# Altium project PCB_Project.PrjPcb
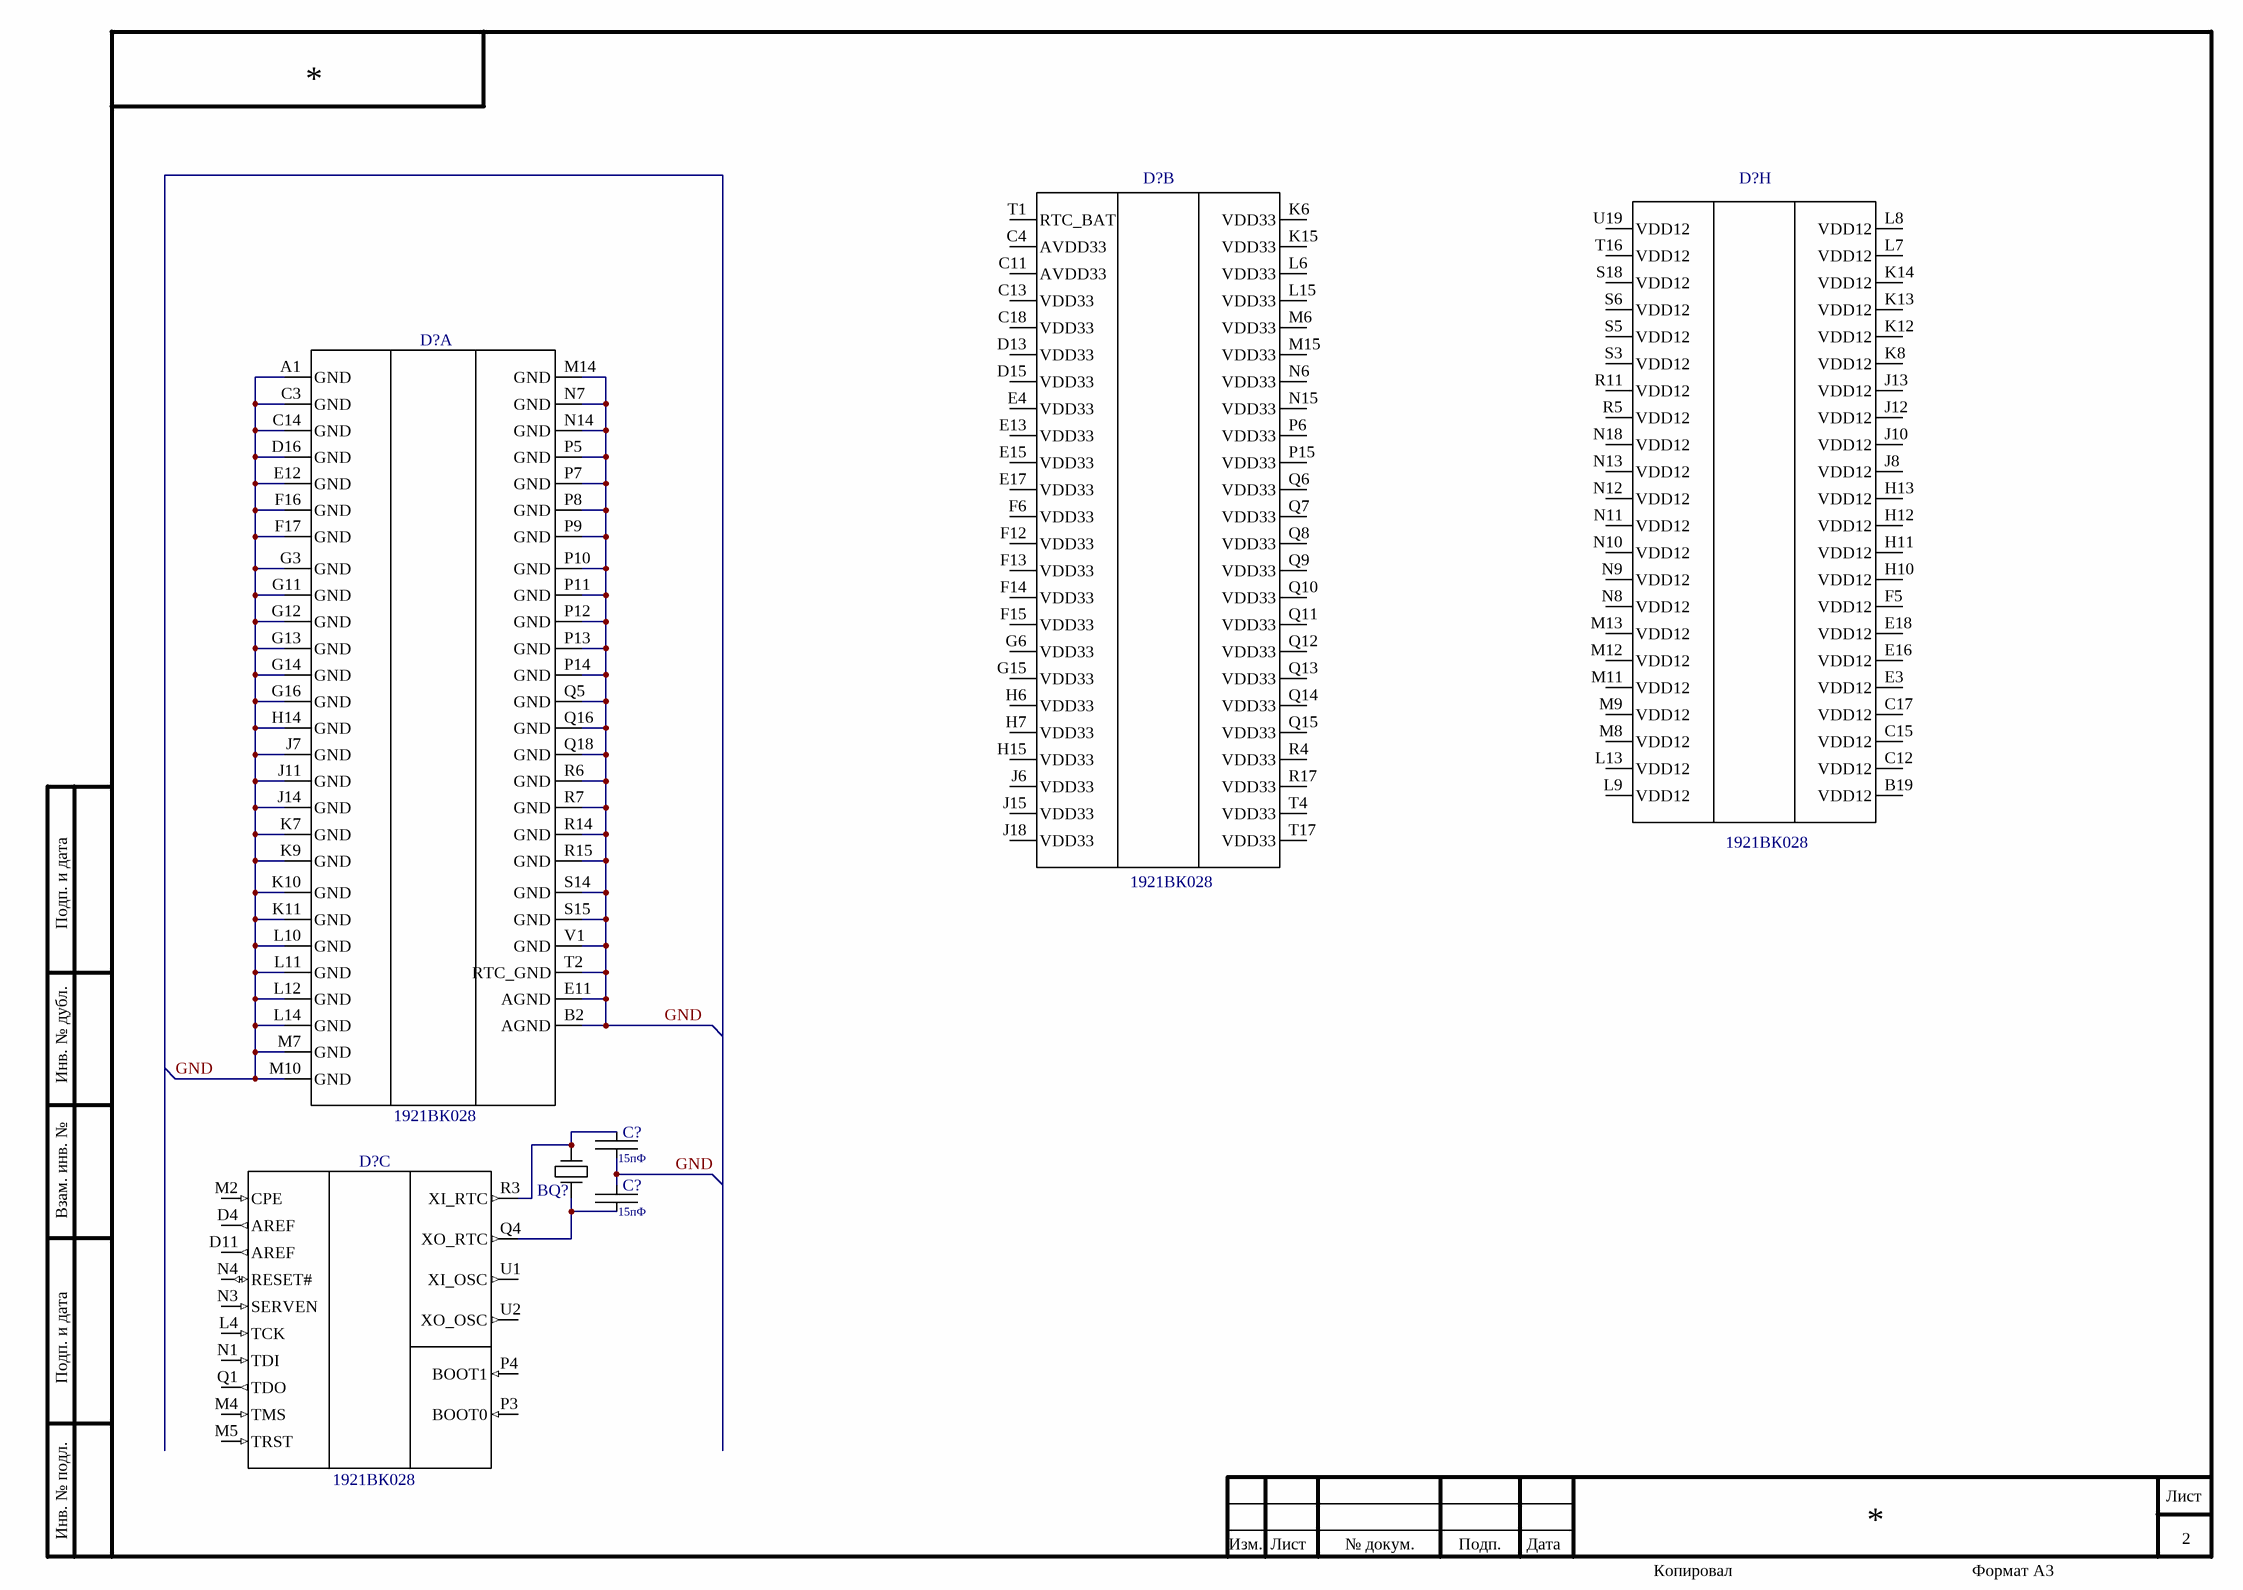
[diagram p0: MCU1.SchDoc]
3 sheets, 45 parts. Net scope: global (net labels, ports and power ports of the same name join across sheets).
Sheets:
  MCU1.SchDoc
  MCU2.SchDoc
  InterfMCU.SchDoc

## Sheet MCU1.SchDoc
size 420 x 297 mm; Address1: Address1; Address2: Address2; Address3: Address3; Address4: Address4; SheetNumber: 2; SheetTotal: 4; Scale: 1:1; DocumentType: Схема электрическая принципиальная

### Parts
(Parts that share a designator on the sheet are numbered #1, #2 ... from top to bottom, then left to right.)
BQ?  РК206  (value not drawn)
C?#1  15пФ
C?#2  15пФ
D?#1  1921ВК028  (part H of 8)
D?#2  1921ВК028  (part B of 8)
D?#3  1921ВК028  (part A of 8)
D?#4  1921ВК028  (part C of 8)

### Nets
GND: C?#1.2 C?#2.1 D?#3.A1(GND) D?#3.B2(AGND) D?#3.C3(GND) D?#3.C14(GND) D?#3.D16(GND) D?#3.E11(AGND) D?#3.E12(GND) D?#3.F16(GND) D?#3.F17(GND) D?#3.G3(GND) D?#3.G11(GND) D?#3.G12(GND) D?#3.G13(GND) D?#3.G14(GND) D?#3.G16(GND) D?#3.H14(GND) D?#3.J7(GND) D?#3.J11(GND) D?#3.J14(GND) D?#3.K7(GND) D?#3.K9(GND) D?#3.K10(GND) D?#3.K11(GND) D?#3.L10(GND) D?#3.L11(GND) D?#3.L12(GND) D?#3.L14(GND) D?#3.M7(GND) D?#3.M10(GND) D?#3.M14(GND) D?#3.N7(GND) D?#3.N14(GND) D?#3.P5(GND) D?#3.P7(GND) D?#3.P8(GND) D?#3.P9(GND) D?#3.P10(GND) D?#3.P11(GND) D?#3.P12(GND) D?#3.P13(GND) D?#3.P14(GND) D?#3.Q5(GND) D?#3.Q16(GND) D?#3.Q18(GND) D?#3.R6(GND) D?#3.R7(GND) D?#3.R14(GND) D?#3.R15(GND) D?#3.S14(GND) D?#3.S15(GND) D?#3.T2(RTC_GND) D?#3.V1(GND)
NetBQ?_1: BQ?.1 C?#2.2 D?#4.Q4(XO_RTC)
NetBQ?_4: BQ?.4 C?#1.1 D?#4.R3(XI_RTC)

Not connected (* = marked no-connect by the designer): D?#1 B19(VDD12) C12(VDD12) C15(VDD12) C17(VDD12) E3(VDD12) E16(VDD12) E18(VDD12) F5(VDD12) H10(VDD12) H11(VDD12) H12(VDD12) H13(VDD12) J8(VDD12) J10(VDD12) J12(VDD12) J13(VDD12) K8(VDD12) K12(VDD12) K13(VDD12) K14(VDD12) L7(VDD12) L8(VDD12) L9(VDD12) L13(VDD12) M8(VDD12) M9(VDD12) M11(VDD12) M12(VDD12) M13(VDD12) N8(VDD12) N9(VDD12) N10(VDD12) N11(VDD12) N12(VDD12) N13(VDD12) N18(VDD12) R5(VDD12) R11(VDD12) S3(VDD12) S5(VDD12) S6(VDD12) S18(VDD12) T16(VDD12) U19(VDD12); D?#2 C4(AVDD33) C11(AVDD33) C13(VDD33) C18(VDD33) D13(VDD33) D15(VDD33) E4(VDD33) E13(VDD33) E15(VDD33) E17(VDD33) F6(VDD33) F12(VDD33) F13(VDD33) F14(VDD33) F15(VDD33) G6(VDD33) G15(VDD33) H6(VDD33) H7(VDD33) H15(VDD33) J6(VDD33) J15(VDD33) J18(VDD33) K6(VDD33) K15(VDD33) L6(VDD33) L15(VDD33) M6(VDD33) M15(VDD33) N6(VDD33) N15(VDD33) P6(VDD33) P15(VDD33) Q6(VDD33) Q7(VDD33) Q8(VDD33) Q9(VDD33) Q10(VDD33) Q11(VDD33) Q12(VDD33) Q13(VDD33) Q14(VDD33) Q15(VDD33) R4(VDD33) R17(VDD33) T1(RTC_BAT) T4(VDD33) T17(VDD33); D?#4 D4(AREF) D11(AREF) L4(TCK) M2(CPE) M4(TMS) M5(TRST) N1(TDI) N3(SERVEN) N4(RESET#) P3(BOOT0) P4(BOOT1) Q1(TDO) U1(XI_OSC) U2(XO_OSC)

### Notes on the sheet
- Подп. и дата
- Инв. № дубл.
- Взам. инв. №
- Инв. № подл.
- Изм.
- Лист
- № докум.
- Подп.
- Дата
- Копировал
- Формат А3

### Library data of the parts
BQ? = РК206: Кварцевый резонатор РК206 32кГц
C?#1 C?#2 = К10-69: Керамический чип-конденсатор серии К10-79; PartNumber: К10-69в-*-* В- * ± *% *; TypePrefix: C; TU: АЖЯР.673511.002ТУ; TUHolder: ОАО НИИ "ГИРИКОНД"; Value: *; PackegeType: *
D?#1-D?#4 = 1921ВК028: МК 1921ВК028

## Sheet MCU2.SchDoc
size 420 x 297 mm; Address1: Address1; Address2: Address2; Address3: Address3; Address4: Address4; SheetNumber: 3; SheetTotal: 4; Scale: 1:1; DocumentType: Схема электрическая принципиальная
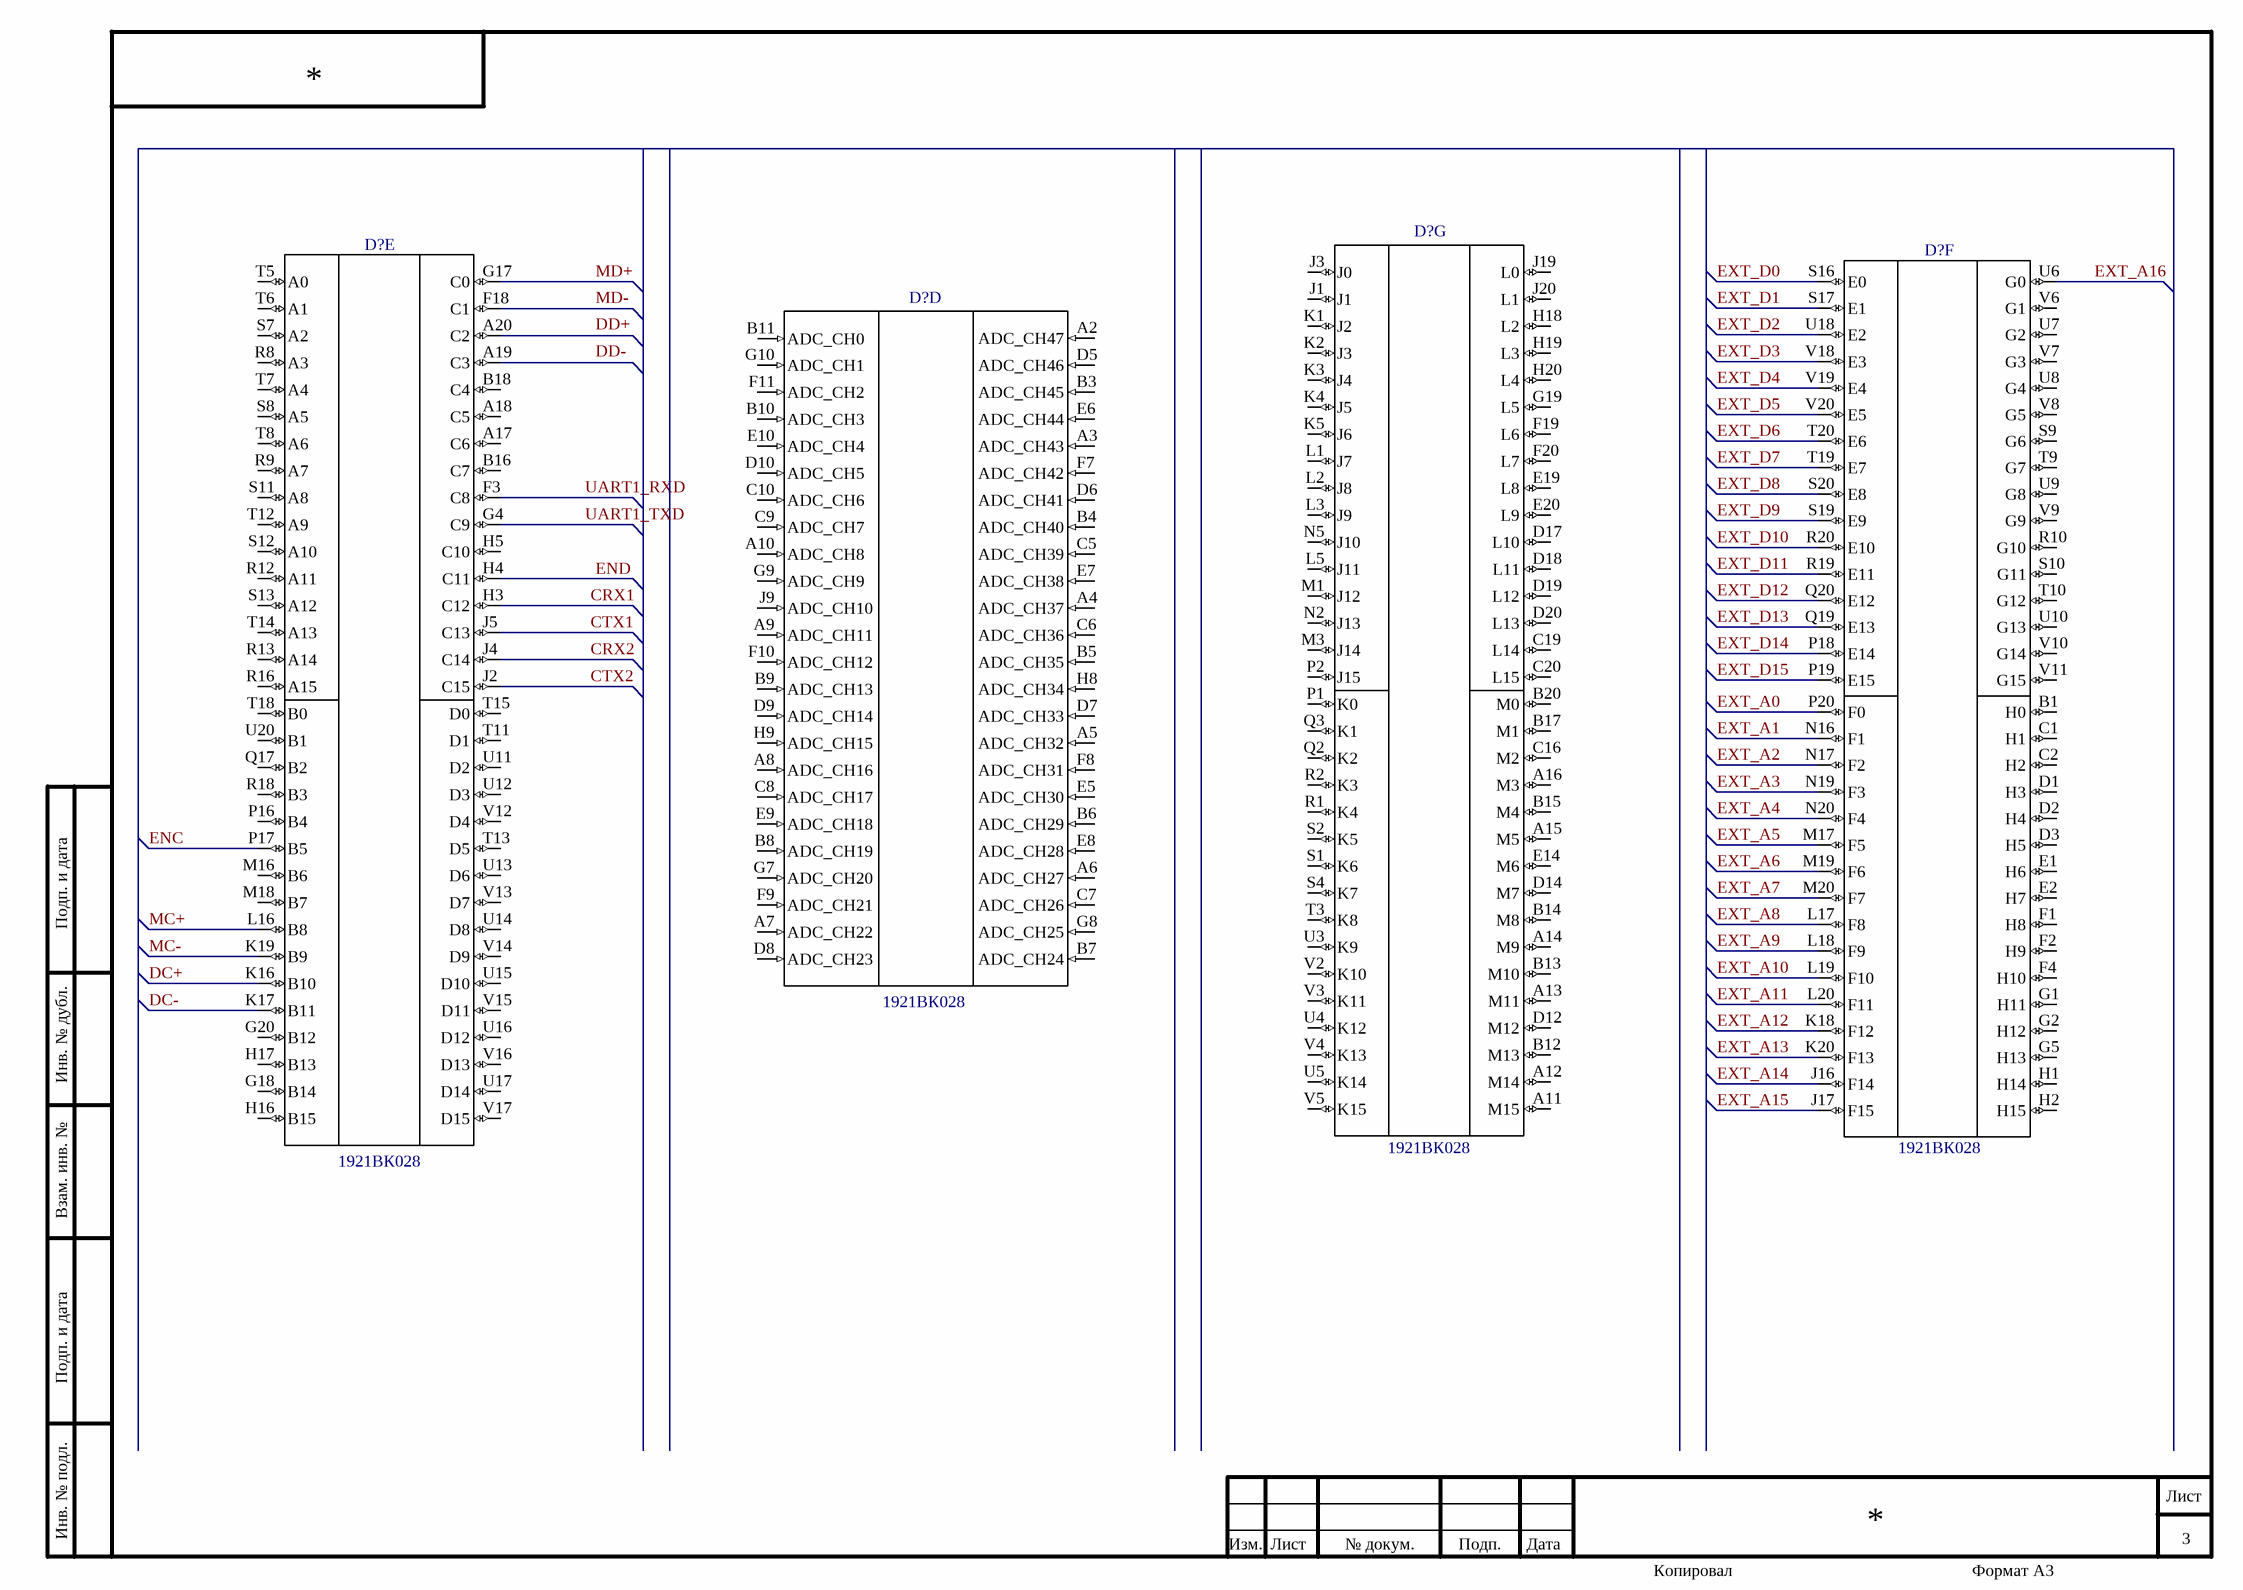
[diagram p1: MCU2.SchDoc]

### Parts
(Parts that share a designator on the sheet are numbered #1, #2 ... from top to bottom, then left to right.)
D?#5  1921ВК028  (part G of 8)
D?#6  1921ВК028  (part E of 8)
D?#7  1921ВК028  (part F of 8)
D?#8  1921ВК028  (part D of 8)

### Nets
CRX1: D?#6.H3(C12)
CRX2: D?#6.J4(C14)
CTX1: D?#6.J5(C13)
CTX2: D?#6.J2(C15)
DC+: D?#6.K16(B10)
DC-: D?#6.K17(B11)
ENC: D?#6.P17(B5)
END: D?#6.H4(C11)
EXT_A0: D?#7.P20(F0)
EXT_A1: D?#7.N16(F1)
EXT_A2: D?#7.N17(F2)
EXT_A3: D?#7.N19(F3)
EXT_A4: D?#7.N20(F4)
EXT_A5: D?#7.M17(F5)
EXT_A6: D?#7.M19(F6)
EXT_A7: D?#7.M20(F7)
EXT_A8: D?#7.L17(F8)
EXT_A9: D?#7.L18(F9)
EXT_A10: D?#7.L19(F10)
EXT_A11: D?#7.L20(F11)
EXT_A12: D?#7.K18(F12)
EXT_A13: D?#7.K20(F13)
EXT_A14: D?#7.J16(F14)
EXT_A15: D?#7.J17(F15)
EXT_A16: D?#7.U6(G0)
EXT_D0: D?#7.S16(E0)
EXT_D1: D?#7.S17(E1)
EXT_D2: D?#7.U18(E2)
EXT_D3: D?#7.V18(E3)
EXT_D4: D?#7.V19(E4)
EXT_D5: D?#7.V20(E5)
EXT_D6: D?#7.T20(E6)
EXT_D7: D?#7.T19(E7)
EXT_D8: D?#7.S20(E8)
EXT_D9: D?#7.S19(E9)
EXT_D10: D?#7.R20(E10)
EXT_D11: D?#7.R19(E11)
EXT_D12: D?#7.Q20(E12)
EXT_D13: D?#7.Q19(E13)
EXT_D14: D?#7.P18(E14)
EXT_D15: D?#7.P19(E15)
MC+: D?#6.L16(B8)
MC-: D?#6.K19(B9)
MD+: D?#6.G17(C0)
MD-: D?#6.F18(C1)
UART1_RXD: D?#6.F3(C8)
UART1_TXD: D?#6.G4(C9)

Not connected (* = marked no-connect by the designer): D?#5 A11(M15) A12(M14) A13(M11) A14(M9) A15(M5) A16(M3) B12(M13) B13(M10) B14(M8) B15(M4) B17(M1) B20(M0) C16(M2) C19(L14) C20(L15) D12(M12) D14(M7) D17(L10) D18(L11) D19(L12) D20(L13) E14(M6) E19(L8) E20(L9) F19(L6) F20(L7) G19(L5) H18(L2) H19(L3) H20(L4) J1 J3(J0) J19(L0) J20(L1) K1(J2) K2(J3) K3(J4) K4(J5) K5(J6) L1(J7) L2(J8) L3(J9) L5(J11) M1(J12) M3(J14) N2(J13) N5(J10) P1(K0) P2(J15) Q2(K2) Q3(K1) R1(K4) R2(K3) S1(K6) S2(K5) S4(K7) T3(K8) U3(K9) U4(K12) U5(K14) V2(K10) V3(K11) V4(K13) V5(K15); D?#6 A17(C6) A18(C5) A19(C3) A20(C2) B16(C7) B18(C4) G18(B14) G20(B12) H5(C10) H16(B15) H17(B13) M16(B6) M18(B7) P16(B4) Q17(B2) R8(A3) R9(A7) R12(A11) R13(A14) R16(A15) R18(B3) S7(A2) S8(A5) S11(A8) S12(A10) S13(A12) T5(A0) T6(A1) T7(A4) T8(A6) T11(D1) T12(A9) T13(D5) T14(A13) T15(D0) T18(B0) U11(D2) U12(D3) U13(D6) U14(D8) U15(D10) U16(D12) U17(D14) U20(B1) V12(D4) V13(D7) V14(D9) V15(D11) V16(D13) V17(D15); D?#7 B1(H0) C1(H1) C2(H2) D1(H3) D2(H4) D3(H5) E1(H6) E2(H7) F1(H8) F2(H9) F4(H10) G1(H11) G2(H12) G5(H13) H1(H14) H2(H15) R10(G10) S9(G6) S10(G11) T9(G7) T10(G12) U7(G2) U8(G4) U9(G8) U10(G13) V6(G1) V7(G3) V8(G5) V9(G9) V10(G14) V11(G15); D?#8 A2(ADC_CH47) A3(ADC_CH43) A4(ADC_CH37) A5(ADC_CH32) A6(ADC_CH27) A7(ADC_CH22) A8(ADC_CH16) A9(ADC_CH11) A10(ADC_CH8) B3(ADC_CH45) B4(ADC_CH40) B5(ADC_CH35) B6(ADC_CH29) B7(ADC_CH24) B8(ADC_CH19) B9(ADC_CH13) B10(ADC_CH3) B11(ADC_CH0) C5(ADC_CH39) C6(ADC_CH36) C7(ADC_CH26) C8(ADC_CH17) C9(ADC_CH7) C10(ADC_CH6) D5(ADC_CH46) D6(ADC_CH41) D7(ADC_CH33) D8(ADC_CH23) D9(ADC_CH14) D10(ADC_CH5) E5(ADC_CH30) E6(ADC_CH44) E7(ADC_CH38) E8(ADC_CH28) E9(ADC_CH18) E10(ADC_CH4) F7(ADC_CH42) F8(ADC_CH31) F9(ADC_CH21) F10(ADC_CH12) F11(ADC_CH2) G7(ADC_CH20) G8(ADC_CH25) G9(ADC_CH9) G10(ADC_CH1) H8(ADC_CH34) H9(ADC_CH15) J9(ADC_CH10)

### Notes on the sheet
- Подп. и дата
- Инв. № дубл.
- Взам. инв. №
- Инв. № подл.
- Изм.
- Лист
- № докум.
- Подп.
- Дата
- Копировал
- Формат А3
- Labels drawn without touching a wire or pin: DD+, DD-

### Library data of the parts
D?#5-D?#8 = 1921ВК028: МК 1921ВК028

## Sheet InterfMCU.SchDoc
size 420 x 297 mm; Address1: Address1; Address2: Address2; Address3: Address3; Address4: Address4; SheetNumber: 4; SheetTotal: 4; Scale: 1:1; DocumentType: Схема электрическая принципиальная
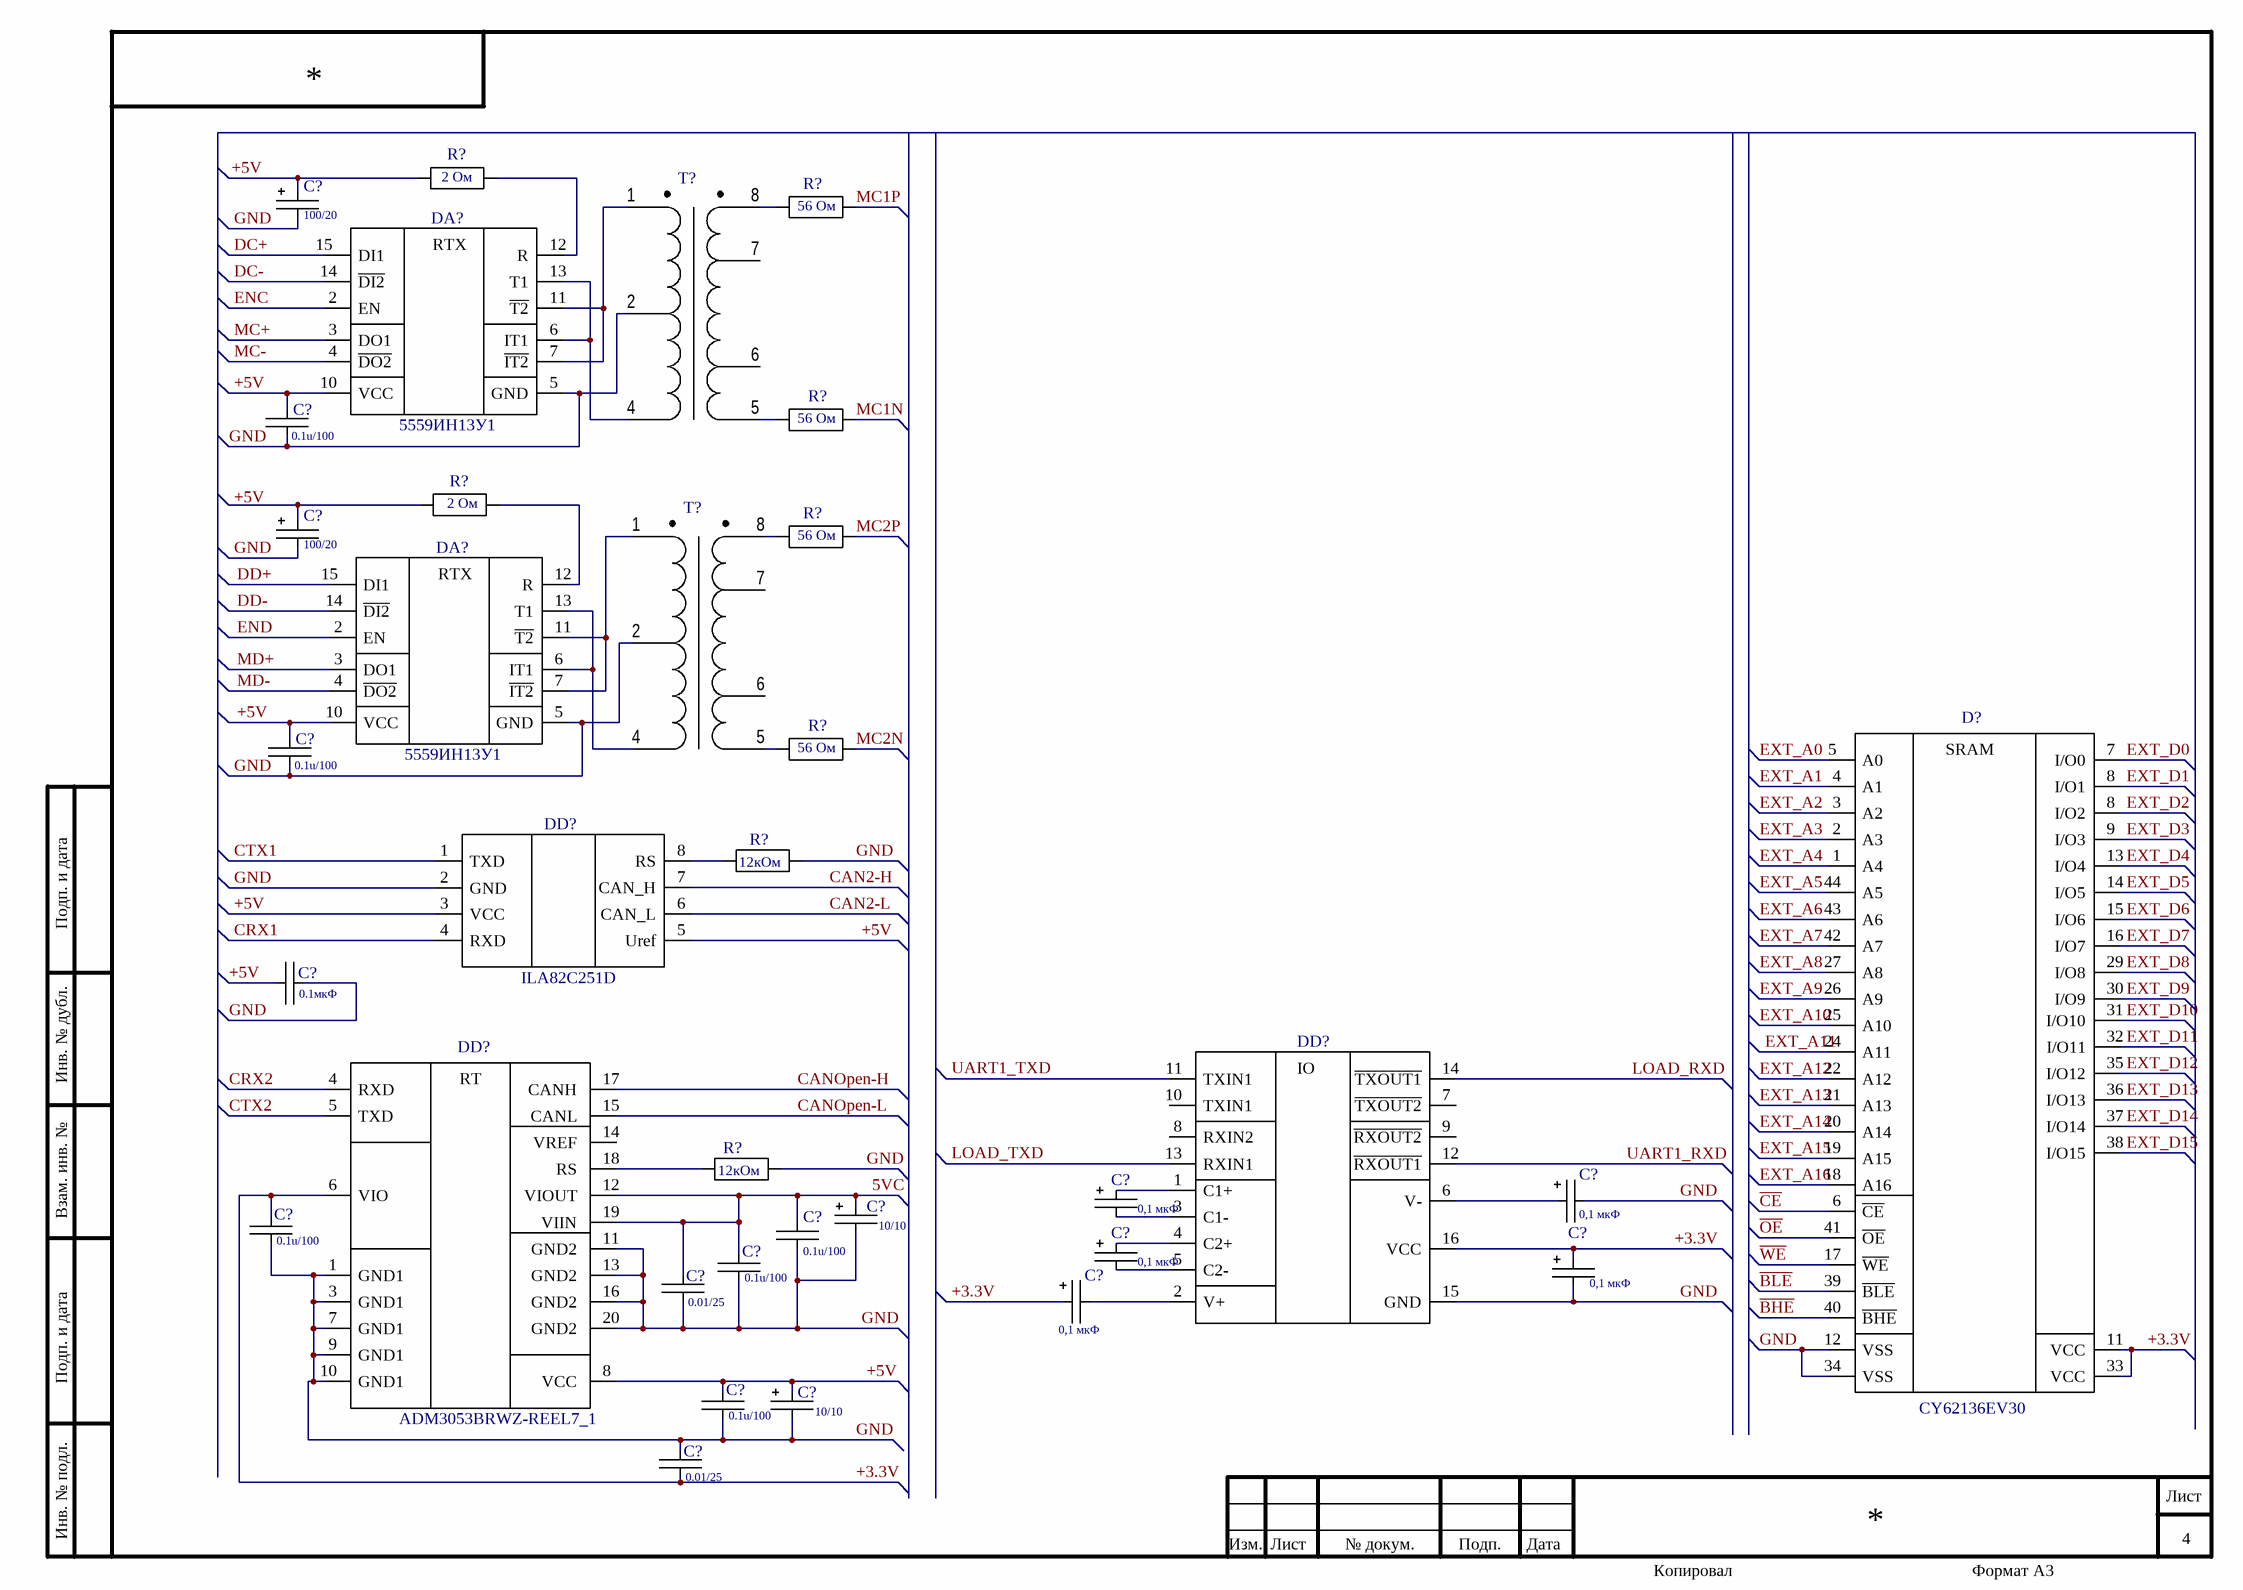
[diagram p2: InterfMCU.SchDoc]

### Parts
(Parts that share a designator on the sheet are numbered #1, #2 ... from top to bottom, then left to right.)
C?#3  100/20
C?#4  0.1u/100
C?#5  100/20
C?#6  0.1u/100
C?#7  0.1мкФ
C?#8  0,1 мкФ
C?#9  0,1 мкФ
C?#10  10/10
C?#11  0.1u/100
C?#12  0.1u/100
C?#13  0,1 мкФ
C?#14  0.1u/100
C?#15  0,1 мкФ
C?#16  0.01/25
C?#17  0,1 мкФ
C?#18  0.1u/100
C?#19  10/10
C?#20  0.01/25
D?#9  CY62136EV30
DA?#1  5559ИН13У1
DA?#2  5559ИН13У1
DD?#1  ILA82C251D
DD?#2  ILX3232  (value not drawn)
DD?#3  ADM3053BRWZ-REEL7_1
R?#1  2 Ом
R?#2  56 Ом
R?#3  56 Ом
R?#4  2 Ом
R?#5  56 Ом
R?#6  56 Ом
R?#7  12кОм
R?#8  12кОм
Т?#1  (no value)
Т?#2  (no value)

### Nets
5VC: C?#10.1 C?#12.1 C?#14.1 C?#16.1 DD?#3.12(VIOUT) DD?#3.19(VIIN)
+3.3V: C?#11.1 C?#15.1 C?#17.1 C?#20.2 D?#9.11(VCC) D?#9.33(VCC) DD?#2.16(VCC) DD?#3.6(VIO)
+5V: C?#3.1 C?#4.1 C?#6.1 C?#7.1 C?#18.1 C?#19.1 DA?#1.10(VCC) DA?#2.10(VCC) DD?#1.3(VCC) DD?#1.5(Uref) DD?#3.8(VCC) R?#1.1
~{BHE}: D?#9.40(~{BHE})
~{BLE}: D?#9.39(~{BLE})
~{CE}: D?#9.6(~{CE})
~{OE}: D?#9.41(~{OE})
~{WE}: D?#9.17(~{WE})
CAN2-H: DD?#1.7(CAN_H)
CAN2-L: DD?#1.6(CAN_L)
CANOpen-H: DD?#3.17(CANH)
CANOpen-L: DD?#3.15(CANL)
CRX1: DD?#1.4(RXD)
CRX2: DD?#3.4(RXD)
CTX1: DD?#1.1(TXD)
CTX2: DD?#3.5(TXD)
DC+: DA?#1.15(DI1)
DC-: DA?#1.14(~{DI2})
DD+: DA?#2.15(DI1)
DD-: DA?#2.14(~{DI2})
ENC: DA?#1.2(EN)
END: DA?#2.2(EN)
EXT_A0: D?#9.5(A0)
EXT_A1: D?#9.4(A1)
EXT_A2: D?#9.3(A2)
EXT_A3: D?#9.2(A3)
EXT_A4: D?#9.1(A4)
EXT_A5: D?#9.44(A5)
EXT_A6: D?#9.43(A6)
EXT_A7: D?#9.42(A7)
EXT_A8: D?#9.27(A8)
EXT_A9: D?#9.26(A9)
EXT_A10: D?#9.25(A10)
EXT_A11: D?#9.24(A11)
EXT_A12: D?#9.22(A12)
EXT_A13: D?#9.21(A13)
EXT_A14: D?#9.20(A14)
EXT_A15: D?#9.19(A15)
EXT_A16: D?#9.18(A16)
EXT_D0: D?#9.7(I/O0)
EXT_D1: D?#9.8(I/O1)
EXT_D2: D?#9.8(I/O2)
EXT_D3: D?#9.9(I/O3)
EXT_D4: D?#9.13(I/O4)
EXT_D5: D?#9.14(I/O5)
EXT_D6: D?#9.15(I/O6)
EXT_D7: D?#9.16(I/O7)
EXT_D8: D?#9.29(I/O8)
EXT_D9: D?#9.30(I/O9)
EXT_D10: D?#9.31(I/O10)
EXT_D11: D?#9.32(I/O11)
EXT_D12: D?#9.35(I/O12)
EXT_D13: D?#9.36(I/O13)
EXT_D14: D?#9.37(I/O14)
EXT_D15: D?#9.38(I/O15)
GND: C?#3.2 C?#4.2 C?#5.2 C?#6.2 C?#7.2 C?#9.2 C?#10.2 C?#11.2 C?#12.2 C?#14.2 C?#15.2 C?#16.2 C?#18.2 C?#19.2 C?#20.1 D?#9.12(VSS) D?#9.34(VSS) DA?#1.5(GND) DA?#2.5(GND) DD?#1.2(GND) DD?#2.15(GND) DD?#3.1(GND1) DD?#3.3(GND1) DD?#3.7(GND1) DD?#3.9(GND1) DD?#3.10(GND1) DD?#3.11(GND2) DD?#3.13(GND2) DD?#3.16(GND2) DD?#3.20(GND2) R?#7.2 R?#8.2 Т?#1.2 Т?#2.2
LOAD_RXD: DD?#2.14(~{TXOUT1})
LOAD_TXD: DD?#2.13(RXIN1)
MC1N: R?#3.2
MC1P: R?#2.2
MC2N: R?#6.2
MC2P: R?#5.2
MC+: DA?#1.3(DO1)
MC-: DA?#1.4(~{DO2})
MD+: DA?#2.3(DO1)
MD-: DA?#2.4(~{DO2})
UART1_RXD: DD?#2.12(~{RXOUT1})
UART1_TXD: DD?#2.11(TXIN1)
NetC?#5_1: C?#5.1 R?#4.1
NetC?#8_1: C?#8.1 DD?#2.1(С1+)
NetC?#8_2: C?#8.2 DD?#2.3(С1-)
NetC?#9_1: C?#9.1 DD?#2.6(V-)
NetC?#13_1: C?#13.1 DD?#2.4(C2+)
NetC?#13_2: C?#13.2 DD?#2.5(C2-)
NetC?#17_2: C?#17.2 DD?#2.2(V+)
NetDA?#1_6: DA?#1.6(IT1) DA?#1.13(T1) Т?#1.4
NetDA?#1_7: DA?#1.7(~{IT2}) DA?#1.11(~{T2}) Т?#1.1
NetDA?#1_12: DA?#1.12(R) R?#1.2
NetDA?#2_6: DA?#2.6(IT1) DA?#2.13(T1) Т?#2.4
NetDA?#2_7: DA?#2.7(~{IT2}) DA?#2.11(~{T2}) Т?#2.1
NetDA?#2_12: DA?#2.12(R) R?#4.2
NetDD?#1_8: DD?#1.8(RS) R?#7.1
NetDD?#3_18: DD?#3.18(RS) R?#8.1
NetR?#2_1: R?#2.1 Т?#1.8
NetR?#3_1: R?#3.1 Т?#1.5
NetR?#5_1: R?#5.1 Т?#2.8
NetR?#6_1: R?#6.1 Т?#2.5

Not connected (* = marked no-connect by the designer): DD?#2 7(~{TXOUT2}) 8(RXIN2) 9(~{RXOUT2}) 10(TXIN1); DD?#3 14(VREF_); Т?#1 6 7; Т?#2 6 7

### Notes on the sheet
- Подп. и дата
- Инв. № дубл.
- Взам. инв. №
- Инв. № подл.
- Изм.
- Лист
- № докум.
- Подп.
- Дата
- Копировал
- Формат А3
- Labels drawn without touching a wire or pin: +5V
- (in symbol 5559ИН13У1) RTX
- (in symbol ADM3053BRWZ-REEL7_1) RT
- (in symbol CY62136EV30) SRAM
- (in symbol ILX3232) IO

### Library data of the parts
C?#3 C?#5 C?#9 = К53-68E: Конденсатор полярный
C?#4 C?#6 C?#7 C?#16 C?#20 = К10-69: as C?#1 on sheet MCU1; Value: *; PackegeType: *
C?#8 C?#10 C?#13 C?#15 C?#17 C?#19 = К53-68B: Конденсатор / полярный
C?#11 C?#12 C?#14 C?#18 = К10-69в-3225: Конденсатор неполярный
D?#9 = CY62136EV30: СОЗУ CY62136EV30 256КБ
DA?#1 DA?#2 = 5559ИН13У1: МКИО приемопередатчик 5559ИН13Т
DD?#1 = ILA82C251D: CAN Приемопередатчик  ILA82C251D
DD?#2 = ILX3232: RS-232 Приемопередатчик ILX3232
DD?#3 = ADM3053BRWZ-REEL7_1: Микросборка CAN с гальванической развязкой
R?#1-R?#6 = Р1-12-0,5: Резистор постоянный
R?#7 R?#8 = Р1-12-0,125: Резистор постоянный
Т?#1 Т?#2 = ТИЛ6В: Трансформатор для ГОСТ Р 52070-2003

## Nets that join several sheets
CRX1: MCU2 (D?#6.H3), InterfMCU (DD?#1.4)
CRX2: MCU2 (D?#6.J4), InterfMCU (DD?#3.4)
CTX1: MCU2 (D?#6.J5), InterfMCU (DD?#1.1)
CTX2: MCU2 (D?#6.J2), InterfMCU (DD?#3.5)
DC+: MCU2 (D?#6.K16), InterfMCU (DA?#1.15 )
DC-: MCU2 (D?#6.K17), InterfMCU (DA?#1.14)
ENC: MCU2 (D?#6.P17), InterfMCU (DA?#1.2)
END: MCU2 (D?#6.H4), InterfMCU (DA?#2.2)
EXT_A0: MCU2 (D?#7.P20), InterfMCU (D?#9.5 )
EXT_A1: MCU2 (D?#7.N16), InterfMCU (D?#9.4)
EXT_A2: MCU2 (D?#7.N17), InterfMCU (D?#9.3)
EXT_A3: MCU2 (D?#7.N19), InterfMCU (D?#9.2)
EXT_A4: MCU2 (D?#7.N20), InterfMCU (D?#9.1)
EXT_A5: MCU2 (D?#7.M17), InterfMCU (D?#9.44)
EXT_A6: MCU2 (D?#7.M19), InterfMCU (D?#9.43)
EXT_A7: MCU2 (D?#7.M20), InterfMCU (D?#9.42)
EXT_A8: MCU2 (D?#7.L17), InterfMCU (D?#9.27)
EXT_A9: MCU2 (D?#7.L18), InterfMCU (D?#9.26)
EXT_A10: MCU2 (D?#7.L19), InterfMCU (D?#9.25)
EXT_A11: MCU2 (D?#7.L20), InterfMCU (D?#9.24)
EXT_A12: MCU2 (D?#7.K18), InterfMCU (D?#9.22)
EXT_A13: MCU2 (D?#7.K20), InterfMCU (D?#9.21)
EXT_A14: MCU2 (D?#7.J16), InterfMCU (D?#9.20)
EXT_A15: MCU2 (D?#7.J17), InterfMCU (D?#9.19)
EXT_A16: MCU2 (D?#7.U6), InterfMCU (D?#9.18)
EXT_D0: MCU2 (D?#7.S16), InterfMCU (D?#9.7)
EXT_D1: MCU2 (D?#7.S17), InterfMCU (D?#9.8)
EXT_D2: MCU2 (D?#7.U18), InterfMCU (D?#9.8)
EXT_D3: MCU2 (D?#7.V18), InterfMCU (D?#9.9)
EXT_D4: MCU2 (D?#7.V19), InterfMCU (D?#9.13)
EXT_D5: MCU2 (D?#7.V20), InterfMCU (D?#9.14)
EXT_D6: MCU2 (D?#7.T20), InterfMCU (D?#9.15)
EXT_D7: MCU2 (D?#7.T19), InterfMCU (D?#9.16)
EXT_D8: MCU2 (D?#7.S20), InterfMCU (D?#9.29)
EXT_D9: MCU2 (D?#7.S19), InterfMCU (D?#9.30)
EXT_D10: MCU2 (D?#7.R20), InterfMCU (D?#9.31)
EXT_D11: MCU2 (D?#7.R19), InterfMCU (D?#9.32)
EXT_D12: MCU2 (D?#7.Q20), InterfMCU (D?#9.35)
EXT_D13: MCU2 (D?#7.Q19), InterfMCU (D?#9.36)
EXT_D14: MCU2 (D?#7.P18), InterfMCU (D?#9.37)
EXT_D15: MCU2 (D?#7.P19), InterfMCU (D?#9.38)
GND: MCU1 (54 pins), InterfMCU (34 pins)
MC+: MCU2 (D?#6.L16), InterfMCU (DA?#1.3)
MC-: MCU2 (D?#6.K19), InterfMCU (DA?#1.4)
MD+: MCU2 (D?#6.G17), InterfMCU (DA?#2.3)
MD-: MCU2 (D?#6.F18), InterfMCU (DA?#2.4)
UART1_RXD: MCU2 (D?#6.F3), InterfMCU (DD?#2.12)
UART1_TXD: MCU2 (D?#6.G4), InterfMCU (DD?#2.11)